# EAGLE schematic hkr3000 (EAGLE 6.4)
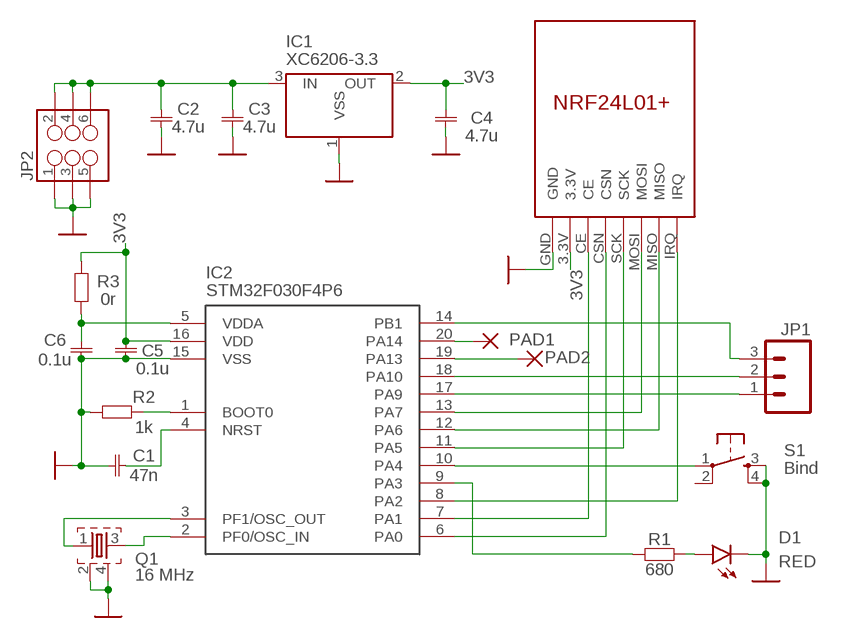
[diagram p0: schematic, sheet 1]

## Parts
C1  47n  C0402  [0402]
C2  4.7u  C0805  [0805]
C3  4.7u  C0805  [0805]
C4  4.7u  C0805  [0805]
C5  0.1u  C0402  [0402]
C6  0.1u  C0402  [0402]
D1  RED  LED-RED0603  [LED-0603]
IC1  XC6206-3.3  XC6206SOT-23  [XC6206_SOT-23]
IC2  STM32F030F4P6  STM32F030XTSSOP20  [TSSOP-20]
JP1  M03PTH  [1X03]
JP2  M03X2POGO_PINS  [2X3_POGO]
PAD1  SMD2  [SMD1,27-2,54]
PAD2  SMD2  [SMD1,27-2,54]
Q1  16 MHz  FA-3225  [FA-20H]
R1  680  R0402  [0402]
R2  1k  R0402  [0402]
R3  0r  R0603  [0603]
S1  Bind  TAC_SWITCHPTH  [TACTILE-PTH]
U$1  NRF24L01  [NRF24L01]

## Nets
3V3: C4.P$2 C5.P$2 IC1.2(OUT) IC2.16(VDD) R3.P$2 U$1.3.3V
3V3-1: C6.P$2 IC2.5(VDDA) R3.P$1
GND: C1.P$1 C2.P$1 C3.P$1 C4.P$1 C5.P$1 C6.P$1 D1.C IC1.1(VSS) IC2.15(VSS) JP2.P$1 JP2.P$3 JP2.P$5 Q1.2 Q1.4 R2.P$1 S1.3 S1.4 U$1.GND
N$1: C2.P$2 C3.P$2 IC1.3(IN) JP2.P$2 JP2.P$4 JP2.P$6
N$2: D1.A R1.P$2
N$3: IC2.20(PA14) PAD1.1(P)
N$4: IC2.11(PA5) U$1.SCK
N$5: IC2.12(PA6) U$1.MISO
N$6: IC2.13(PA7) U$1.MOSI
N$7: IC2.17(PA9) JP1.1
N$8: IC2.18(PA10) JP1.2
N$9: IC2.14(PB1) JP1.3
N$10: IC2.2(PF0/OSC_IN) Q1.3
N$11: IC2.3(PF1/OSC_OUT) Q1.1
N$12: C1.P$2 IC2.4(NRST)
N$13: IC2.1(BOOT0) R2.P$2
N$14: IC2.9(PA3) R1.P$1
N$15: IC2.19(PA13) PAD2.1(P)
N$16: IC2.7(PA1) U$1.CE
N$17: IC2.6(PA0) U$1.CSN
N$18: IC2.8(PA2) U$1.IRQ
N$19: IC2.10(PA4) S1.1
Unconnected: S1.2

## Library data of the parts
C1-C6 = RC.v2:C
D1 = led:LED-RED: Assorted Red LEDs LilyPad 1206- DIO-09912 1206- DIO-00809 0603- DIO-00819; PROD_ID: DIO-00819
IC1 = XC6206:XC6206: XC6206P , linear regulator. Producted by TOREX.Co Store Information: EXCEL device corporation http://www.excel-d.com/access/index.html
IC2 = stm32f030x:STM32F030X
JP1 = SparkFun-Connectors:M03: Header 3 Standard 3-pin 0.1" header. Use with straight break away headers (SKU : PRT-00116), right angle break away headers (PRT-00553), swiss pins (PRT-00743), machine pins (PRT-00117), and female headers (PRT-00115). Molex polarized connector foot print use with SKU : PRT-08232 with associated crimp pins and housings.
JP2 = SparkFun-Connectors:M03X2: 2x3 .1" header. Shrouded, with keying- CONN-10681 SMT- CONN-11415 Pogo pins- HW-11044; PROD_ID: HW-11044
PAD1 PAD2 = pad:SMD2: SMD PAD
Q1 = resonator:FA-: MHz RANGE CRYSTAL UNIT Source: Epson Toyocom
R1-R3 = RC.v2:R
S1 = SparkFun-Electromechanical:TAC_SWITCH: Momentary Switch Button commonly used for reset or general input. Spark Fun Electronics SKU : COM-00097 SMT- SWCH-08247
U$1 = eBay parts:NRF24L01: NRF24L01+ module from eBay NOTE: Untested layout